# Altium schematic sheet MPU-9250.SchDoc
size A
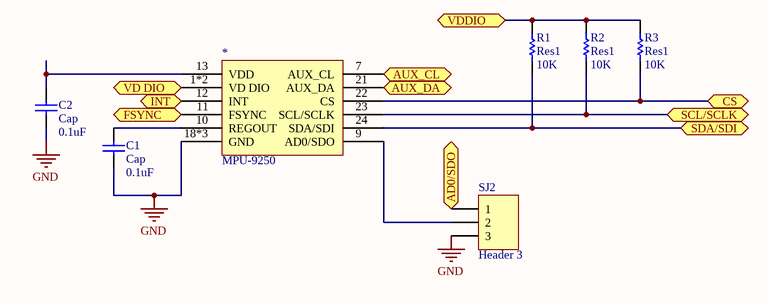
[diagram p0: MPU-9250.SchDoc]

## Parts
*  MPU-9250
C1  Cap  value 0.1uF  [RAD-0.3]
C2  Cap  value 0.1uF  [RAD-0.3]
R1  Res1  value 10K  [AXIAL-0.3]
R2  Res1  value 10K  [AXIAL-0.3]
R3  Res1  value 10K  [AXIAL-0.3]
SJ2  Header 3  [HDR1X3]

## Ports
AD0/SDO, AUX_CL, AUX_DA, CS, FSYNC, INT, SCL/SCLK, SDA/SDI, VD DIO, VDDIO

## Nets
GND: *.18*3(GND) C1.1 C2.1 SJ2.3
AD0/SDO: SJ2.1 ; port AD0/SDO
AUX_CL: *.7(AUX_CL) ; port AUX_CL
AUX_DA: *.21(AUX_DA) ; port AUX_DA
CS: *.22(CS) R3.1 ; port CS
FSYNC: *.11(FSYNC) ; port FSYNC
INT: *.12(INT) ; port INT
SCL/SCLK: *.23(SCL/SCLK) R2.1 ; port SCL/SCLK
SDA/SDI: *.24(SDA/SDI) R1.1 ; port SDA/SDI
VD DIO: *.1*2(VD_DIO) ; port VD DIO
VDDIO: R1.2 R2.2 R3.2 ; port VDDIO
Net*_9: *.9(AD0/SDO) SJ2.2
Net*_10: *.10(REGOUT) C1.2
Net*_13: *.13(VDD) C2.2

## Library data of the parts
* = Component_1
C1 C2 = Cap: Capacitor; Published: 8-Jun-2000; LatestRevisionDate: 17-Jul-2002; LatestRevisionNote: Re-released for DXP Platform.; PackageReference: RAD-0.3; Publisher: Altium Limited; PackageDescription: Radial Cap, Thru-Hole; 2 Leads; 0.3 in Pin Spacing
R1-R3 = Res1: Resistor; Published: 8-Jun-2000; LatestRevisionDate: 17-Jul-2002; LatestRevisionNote: Re-released for DXP Platform.; PackageReference: AXIAL-0.3; Publisher: Altium Limited; PackageDescription: Axial Device, Thru-Hole; 2 Leads; 0.3 in Pin Spacing
SJ2 = Header 3: Header, 3-Pin; LatestRevisionDate: 17-Jul-2002; LatestRevisionNote: Re-released for DXP Platform.; Publisher: Altium Limited